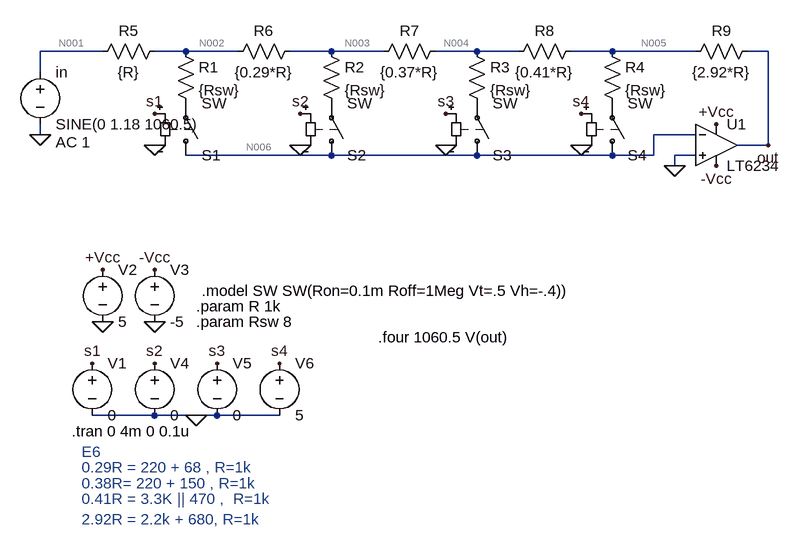
[diagram p0: schematic Etaj3.asc]
* Etaj3.asc
R1 N002 P001 {Rsw}
R2 N003 P002 {Rsw}
R3 N004 P003 {Rsw}
S1 N006 P001 s1 0 SW
S2 N006 P002 s2 0 SW
S3 N006 P003 s3 0 SW
S4 N006 P004 s4 0 SW
* U1: LT6234 (symbol OpAmps\LT6234 not available, pins judged from their places): In+=0 In-=N006 V+=+Vcc V-=-Vcc OUT=out
R5 N002 N001 {R}
R6 N003 N002 {0.29*R}
R7 N004 N003 {0.37*R}
R8 N005 N004 {0.41*R}
R9 out N005 {2.92*R}
V§in N001 0 SINE(0 1.18 1060.5) AC 1
V2 +Vcc 0 5
V3 -Vcc 0 -5
V1 s1 0 0
V4 s2 0 0
V5 s3 0 0
V6 s4 0 5
R4 N005 P004 {Rsw}
.param Rsw 8
.param R 1k
.tran 0 4m 0 0.1u
.model SW SW(Ron=0.1m Roff=1Meg Vt=.5 Vh=-.4))
* 0.29R = 220 + 68 , R=1k
* 0.38R= 220 + 150 , R=1k
* E6
* 0.41R = 3.3K || 470 ,  R=1k
* 2.92R = 2.2k + 680, R=1k
.four 1060.5 V(out)
.backanno
.end

* Results of the author's LTspice run, read from the files saved beside the schematic
* Operating Point, zero values left out:
*   V(n002) = 5.477 µV
*   V(p001) = 5.477 µV
*   V(n003) = 7.067 µV
*   V(p002) = 7.067 µV
*   V(n004) = 9.098 µV
*   V(p003) = 9.098 µV
*   V(n006) = -647.2 nV
*   V(p004) = -647 nV
*   V(s4) = 5 V
*   V(out) = 4.407 mV
*   V(-vcc) = -5 V
*   V(+vcc) = 5 V
*   V(n005) = 11.35 µV
*   I(R1) = 6.124 pA
*   I(R2) = 7.714 pA
*   I(R3) = 9.745 pA
*   I(R5) = 5.477 nA
*   I(R6) = 5.483 nA
*   I(R7) = 5.49 nA
*   I(R8) = 5.5 nA
*   I(R9) = 1.506 µA
*   I(R4) = 1.5 µA
*   I(S1) = 6.124 pA
*   I(S2) = 7.714 pA
*   I(S3) = 9.745 pA
*   I(S4) = 1.5 µA
*   I(In) = 5.477 nA
*   I(V2) = -1.041 mA
*   I(V3) = 1.043 mA
*   Ix(u1:1) = 1.5 µA
*   Ix(u1:2) = 1.5 µA
*   Ix(u1:3) = -1.506 µA
*   Ix(u1:4) = 1.041 mA
*   Ix(u1:5) = -1.043 mA
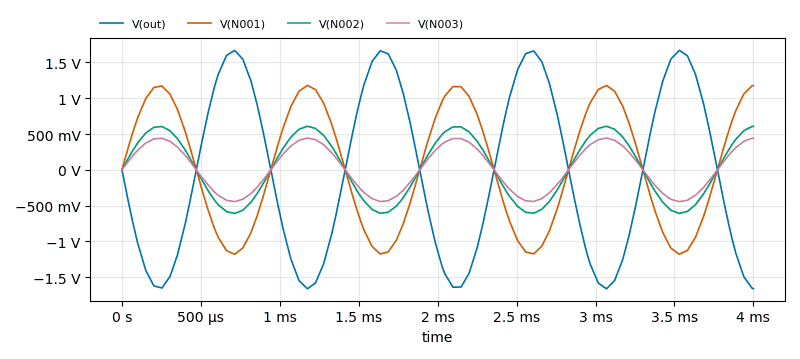
[diagram p1: Transient Analysis of Etaj3.asc, plotted from the saved traces]
* Transient Analysis, 1 run:
*   V(out): min -1.661 V, max 1.669 V, average -54.53 mV, rms 1.172 V, last -1.66 V
*   V(N001): min -1.179 V, max 1.18 V, average 41.75 mV, rms 830.1 mV, last 1.179 V
*   V(N002): min -608.9 mV, max 609.2 mV, average 21.57 mV, rms 428.7 mV, last 608.7 mV
*   V(N003): min -443.8 mV, max 444 mV, average 15.72 mV, rms 312.4 mV, last 443.6 mV
* From the log:
*   N-Period=1
*   Fourier components of V(out)
*   DC component:0.00441897
*   Harmonic  Frequency   Fourier   Normalized   Phase    Normalized
*    Number     [Hz]     Component   Component  [degree]  Phase [deg]
*       1      1.060e+3   1.666e+0   1.000e+0    -90.00°      0.00°
*       2      2.121e+3   5.344e-5   3.208e-5    -26.54°     63.45°
*       3      3.182e+3   5.204e-4   3.124e-4    -87.15°      2.84°
*       4      4.242e+3   1.291e-4   7.751e-5      1.90°     91.89°
*       5      5.302e+3   5.202e-5   3.123e-5     81.80°    171.80°
*       6      6.363e+3   6.493e-4   3.897e-4    149.60°    239.60°
*       7      7.424e+3   2.520e-4   1.513e-4     92.62°    182.61°
*       8      8.484e+3   4.804e-4   2.884e-4    -23.36°     66.64°
*       9      9.544e+3   3.264e-4   1.959e-4   -129.80°    -39.80°
*   Partial Harmonic Distortion: 0.063396%
*   Total Harmonic Distortion:   0.091355%